# Altium project RF-CONNECTOR.PrjPcb
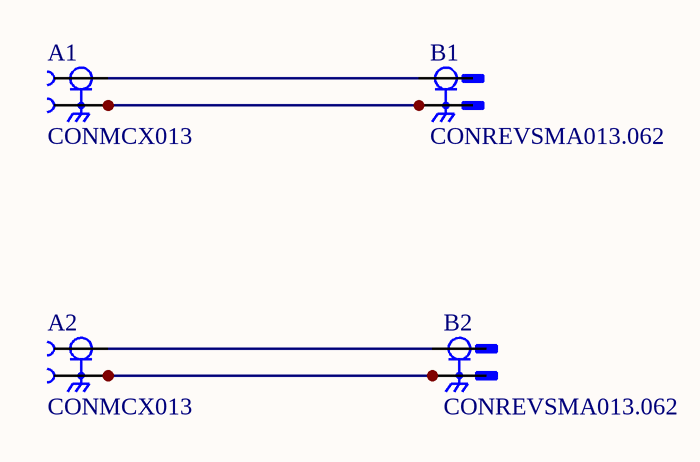
[diagram p0: RF-CONNECTOR.SchDoc]
Version: 1.0.0
1 sheet, 4 parts. Net scope: global (net labels, ports and power ports of the same name join across sheets).
Board file: PCB.PcbDoc

## Sheet RF-CONNECTOR.SchDoc
size A3; Revision: 10

### Parts
A1  CONMCX013  [LINX_CONMCX013]
A2  CONMCX013  [LINX_CONMCX013]
B1  CONREVSMA013.062  [LINX_CONREVSMA013.031]
B2  CONREVSMA013.062  [LINX_CONREVSMA013.031]

### Nets
NetA1_1: A1.1 B1.1
NetA1_G1: A1.G1 A1.G2 B1.S1 B1.S2 B1.S3 B1.S4
NetA2_1: A2.1 B2.1
NetA2_G1: A2.G1 A2.G2 B2.S1 B2.S2 B2.S3 B2.S4

### Library data of the parts
A1 A2 = CONMCX013: RF Connectors / Coaxial Connectors MCX Connector Receptacle, Female Socket 50Ohm Board Edge, Cutout; Surface Mount Solder; MF: Linx Technologies; Value: MCX-F; Package: -- Linx Technologies Inc.; MP: CONMCX013; System: Connector; Type: SMD
B1 B2 = CONREVSMA013.031: CONN RPSMA PLG STR 50OHM EDGEMNT; MF: Linx; Value: RP-SMA; System: Connector; Package: None; MP: CONREVSMA013.062; Type: SMD